# Altium schematic sheet 03_ClockDiagram.SchDoc: Clock diagram
size A3; Organization: Lime Microsystems; Address1: Surrey Tech Centre; Address2: Guildford GU2 7YG; Address3: Surrey; Address4: United Kingdom; SheetNumber: 3
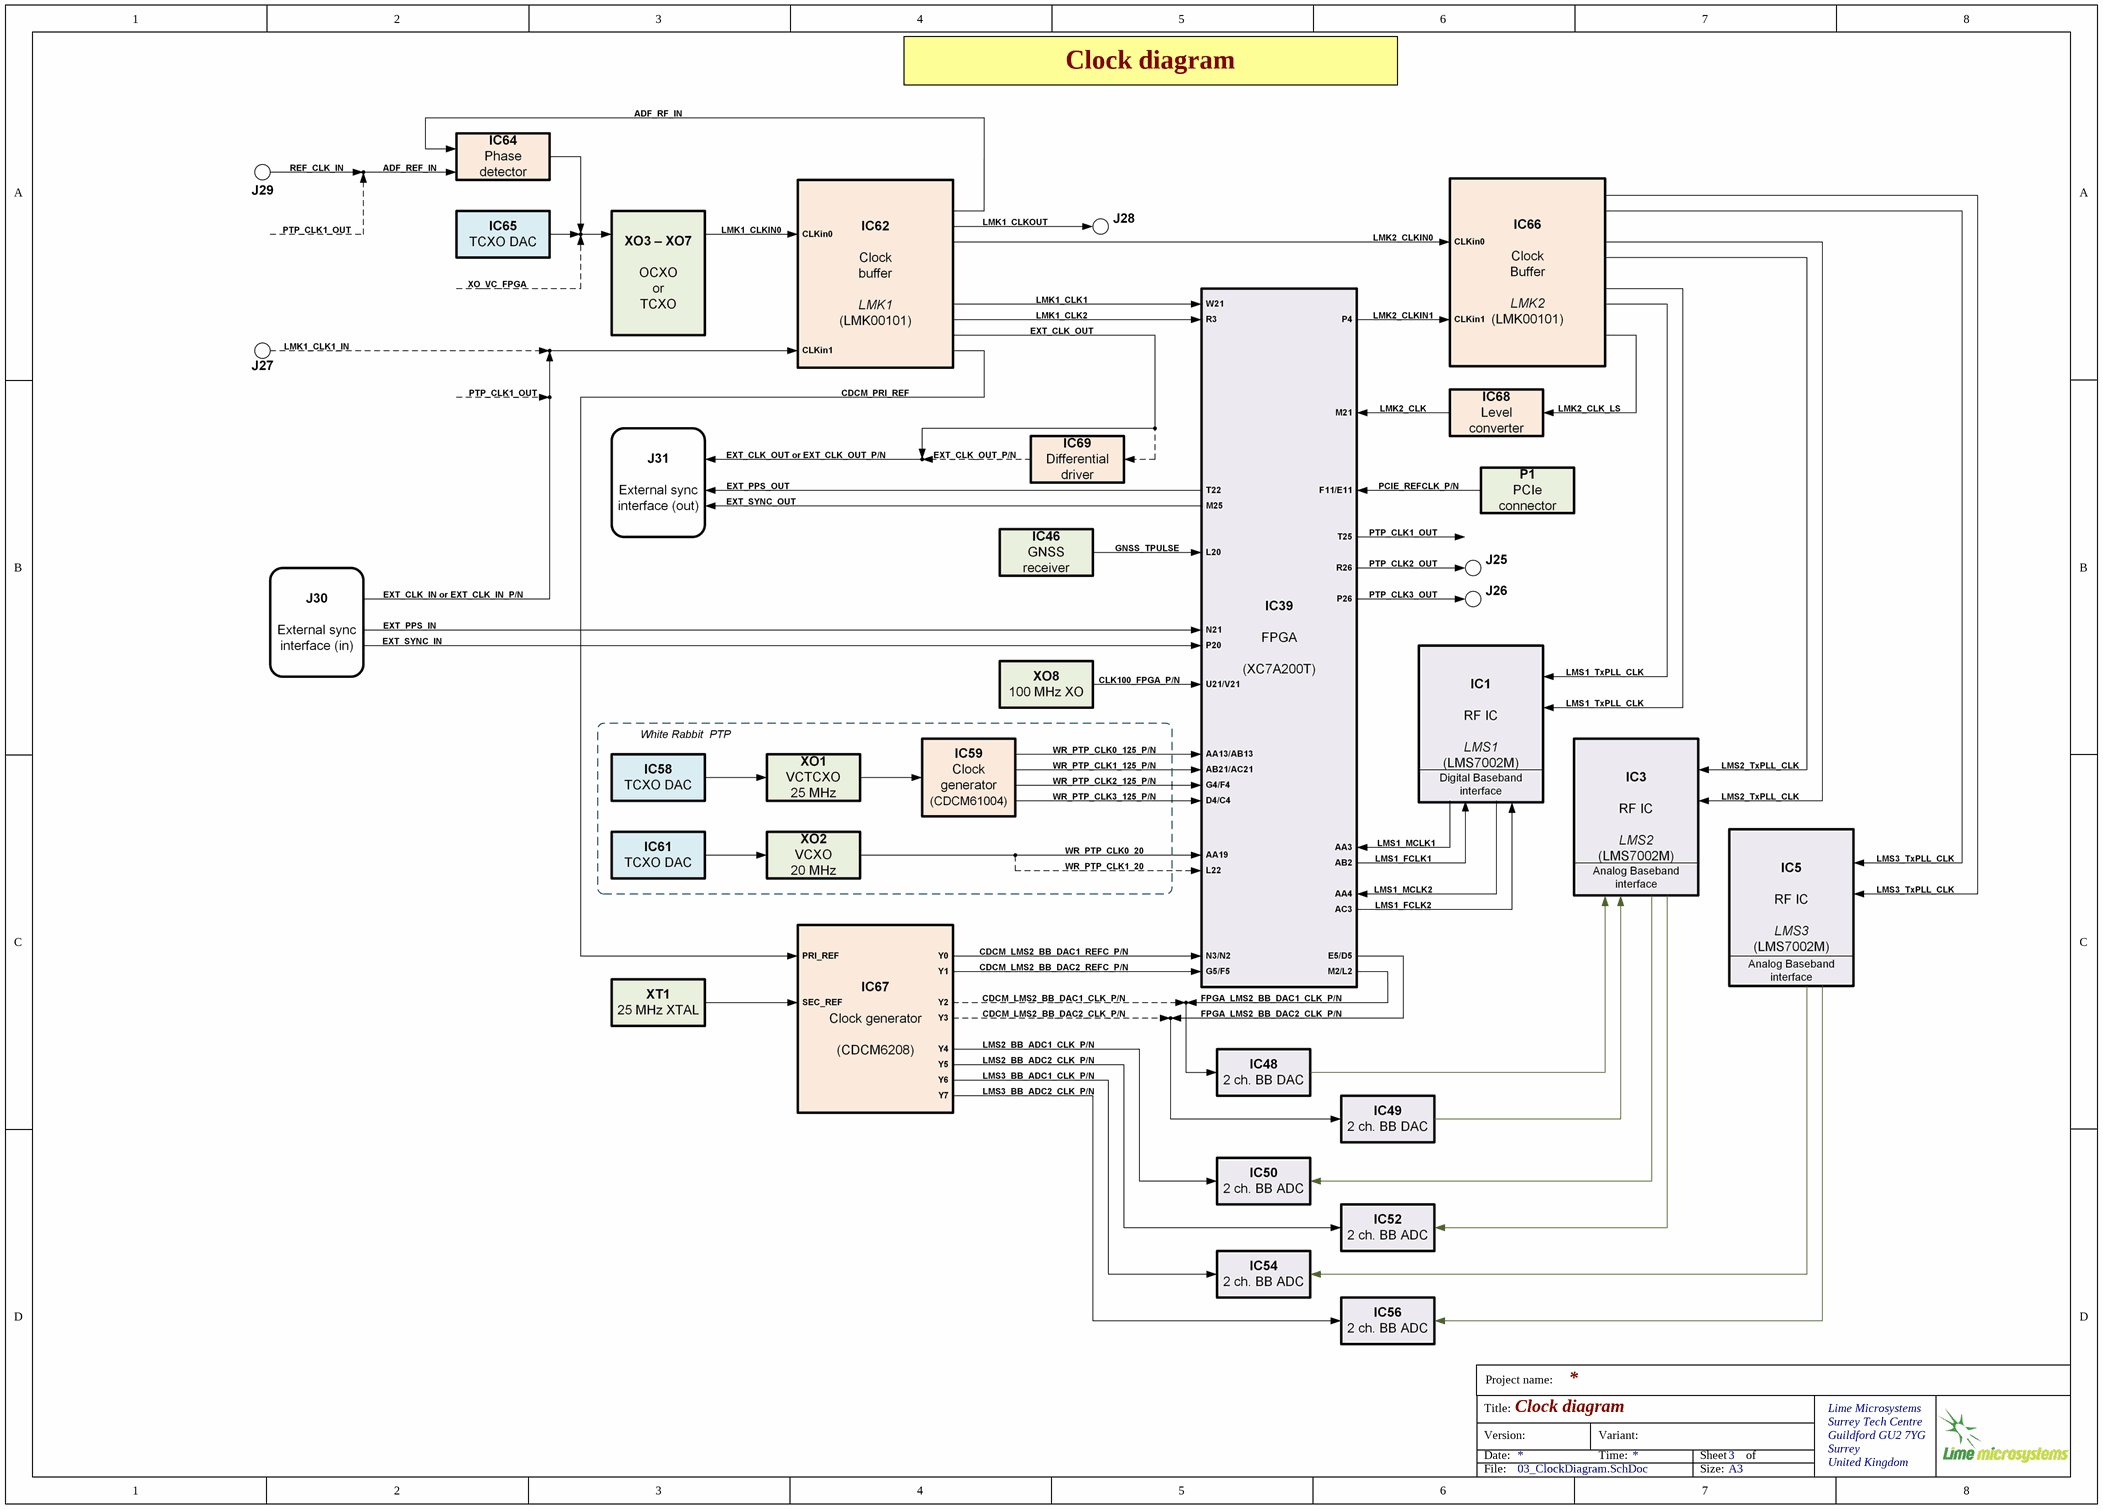
[diagram p0: 03_ClockDiagram.SchDoc]

## Notes on the sheet
- Clock diagram
- Project name:
- Title:
- Version:
- Date:
- Variant:
- Time:
- Sheet
- of
- File:
- Size:
- A3